# Altium project FEU-102-1_part0.PrjPcb
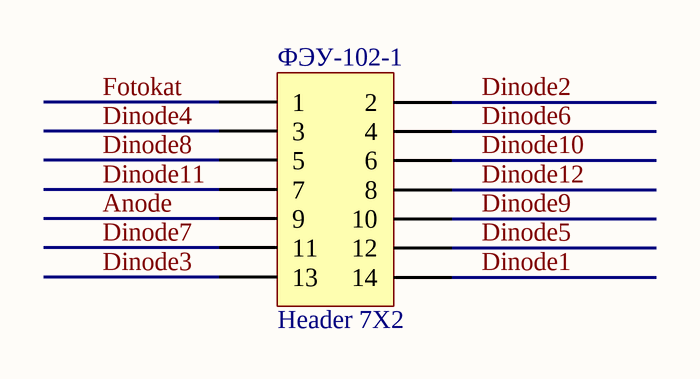
[diagram p0: FEU-102-1_part0.SchDoc]
1 sheet, 1 parts. Net scope: global (net labels, ports and power ports of the same name join across sheets).
Board file: FEU-102-1_part0.PcbDoc

## Sheet FEU-102-1_part0.SchDoc: Делитель ФЭУ-82
size A3; Address1: (с) Быканов Андрей; Address2: г.Тула 2016г.; Revision: 1

### Parts
ФЭУ-102-1  Header 7X2  [ФЭУ-102]

### Nets
Anode: ФЭУ-102-1.9
Dinode1: ФЭУ-102-1.14
Dinode2: ФЭУ-102-1.2
Dinode3: ФЭУ-102-1.13
Dinode4: ФЭУ-102-1.3
Dinode5: ФЭУ-102-1.12
Dinode6: ФЭУ-102-1.4
Dinode7: ФЭУ-102-1.11
Dinode8: ФЭУ-102-1.5
Dinode9: ФЭУ-102-1.10
Dinode10: ФЭУ-102-1.6
Dinode11: ФЭУ-102-1.7
Dinode12: ФЭУ-102-1.8
Fotokat: ФЭУ-102-1.1

### Notes on the sheet
- Title
- Size:
- Date:
- A3
- Number:
- Time:
- Revision:
- Sheet
- of
- File:

### Library data of the parts
ФЭУ-102-1 = Header 7X2: Header, 7-Pin, Dual row; LatestRevisionDate: 17-Jul-2002; LatestRevisionNote: Re-released for DXP Platform.; Publisher: Altium Limited